# EAGLE design FrontPanel (EAGLE 6.6.0)
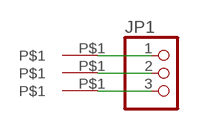
[diagram p0: schematic, sheet 1]

## Parts
JP1  PINHD-1X3_2.54-SMD  [1X03SMD]
U$8  TOUCHPAD  [TOUCH_FIELD_10X5]
U$9  TOUCHPAD  [TOUCH_FIELD_10X5]
U$10  TOUCHPAD  [TOUCH_FIELD_10X5]

## Nets
N$1: JP1.1 U$8.P$1
N$2: JP1.2 U$9.P$1
N$3: JP1.3 U$10.P$1

## Library data of the parts
JP1 = pinhead:PINHD-1X3: PIN HEADER; OC_DIGIKEY: S5595-ND; PRICE_100: 0.536
U$8-U$10 = TinyMix3-FrontPanel:TOUCHPAD

## Board
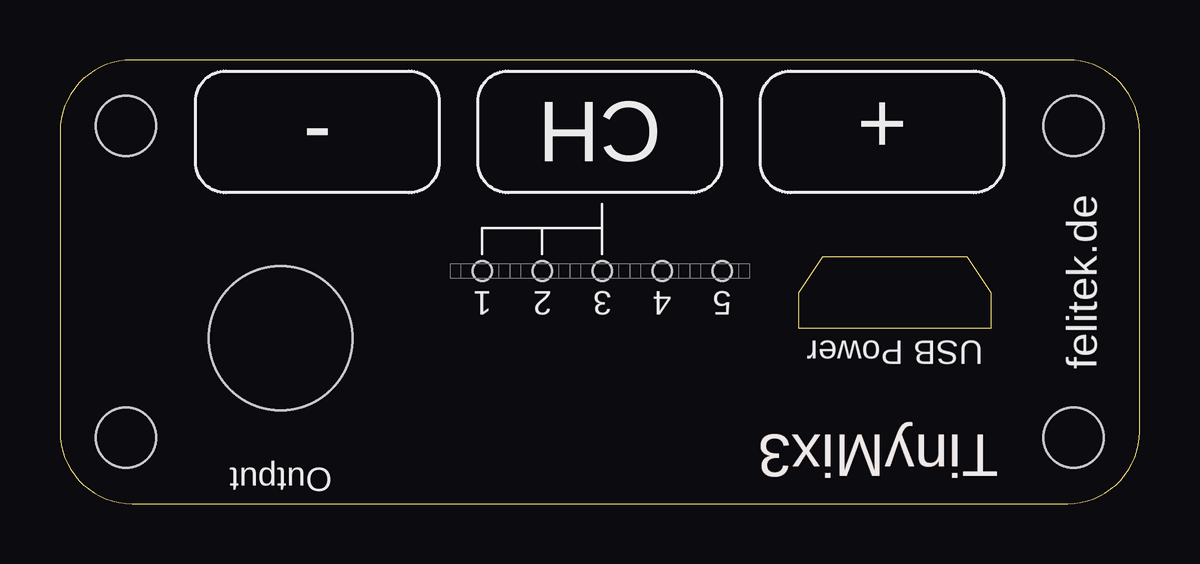
[diagram p1: board, top side]
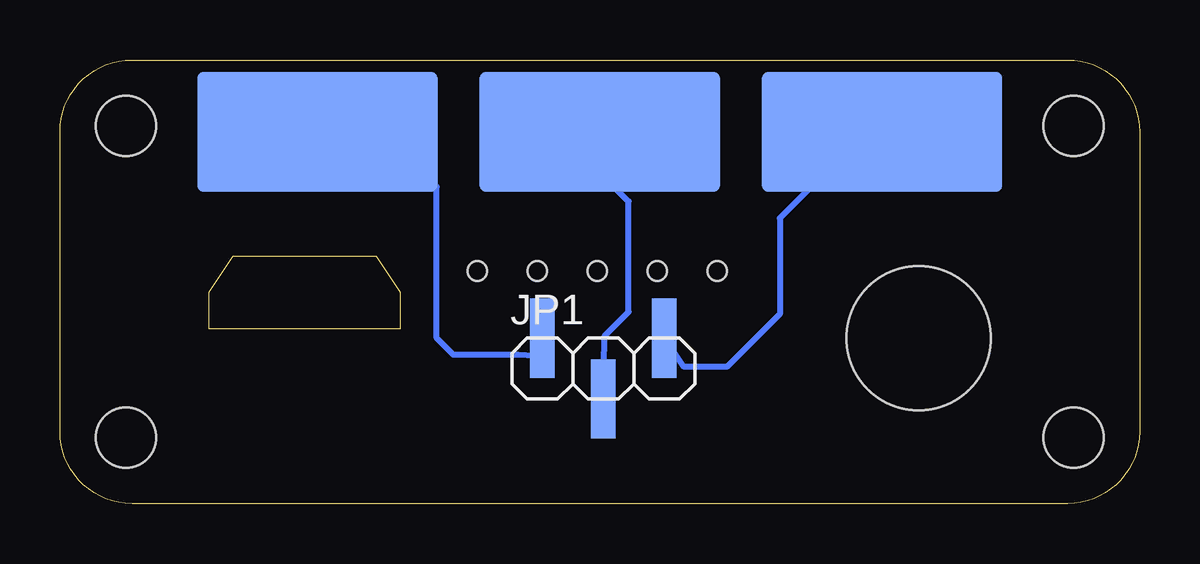
[diagram p2: board, bottom side, seen from below]

Size 45 x 18.5 mm. Coordinates in mm from the lower left corner, seen from the top.
Outline: 3,0 42,0 arc90 45,3 45,15.5 arc90 42,18.5 3,18.5 arc90 0,15.5 0,3 arc90 3,0
Copper layers (1*16): Top 0.0356mm / dielectric 1.5011mm / Bottom 0.0356mm
Design rules "LaenPCBOrder": minimum track width 6mil, minimum drill 13mil, track to track 6mil, track to pad 6mil, pad to pad 6mil, via to via 6mil, smd to smd 6mil, copper to edge 15mil, drill to drill 6mil, minimum pad ring 7mil, minimum via ring 7mil, stop-mask expansion 3mil, vias tented up to drill 0mil, thermal gap 10mil
Holes 2.5 mm at 2.75,2.75 2.75,15.75 42.25,15.75 42.25,2.75
bKeepout: area 1.4,10 to 43.6,11.6

### Footprints (pad centres in the part's own frame; a part is rotated, then mirrored left to right if it is on the bottom)
1X03SMD = smd 1.016 x 3.302: 1 -2.54,1.27; 2 0,-1.27; 3 2.54,1.27
FC68125-FP = hole 6: 0,0
SMDLED_RIGHTANGLE0602 = hole 0.8: -0.1,0
TOUCH_FIELD_10X5 = smd 10 x 5 bottom: P$1 0,0

### Placement (x,y rotation side)
JP1  22.35,5.63 0 bottom
U$1  [FC68125-FP]  9.2,6.9 0 top
U$2  [SMDLED_RIGHTANGLE0602]  27.5,9.7 180 top
U$3  [SMDLED_RIGHTANGLE0602]  25,9.7 180 top
U$4  [SMDLED_RIGHTANGLE0602]  22.5,9.7 180 top
U$5  [SMDLED_RIGHTANGLE0602]  20,9.7 180 top
U$6  [SMDLED_RIGHTANGLE0602]  17.5,9.7 180 top
U$7  [SMD-USB-PANEL]  34.8,8.8 180 top
U$8  34.27,15.5 0 top
U$9  22.5,15.5 0 top
U$10  10.73,15.5 0 top

### Tracks (layer width: path | path; a pad name or v marks a point on that pad's centre or on a via)
N$1
  Bottom 0.254: JP1.1 24.84,6.14 25.9,6.2 28.6,6.2 29.3,6.9 29.3,13.2 31.3,15.2 33.97,15.2 U$8.P$1
N$2
  Bottom 0.254: JP1.2 22.3,7 21.3,8 21.3,12.6 22.5,13.8 U$9.P$1
N$3
  Bottom 0.254: U$10.P$1 11.4,15.5 15,11.9 15,7.9 17.2,5.7 18.98,5.7 JP1.3

### Text on the board
Top: TinyMix3
tNames: - | CH | + | felitek.de | 1 | 2 | 3 | 4 | 5 | USB Power | TinyMix3 | Output